# EAGLE board csa_blitter-v2.1b (EAGLE 5.11), part 1 of 2
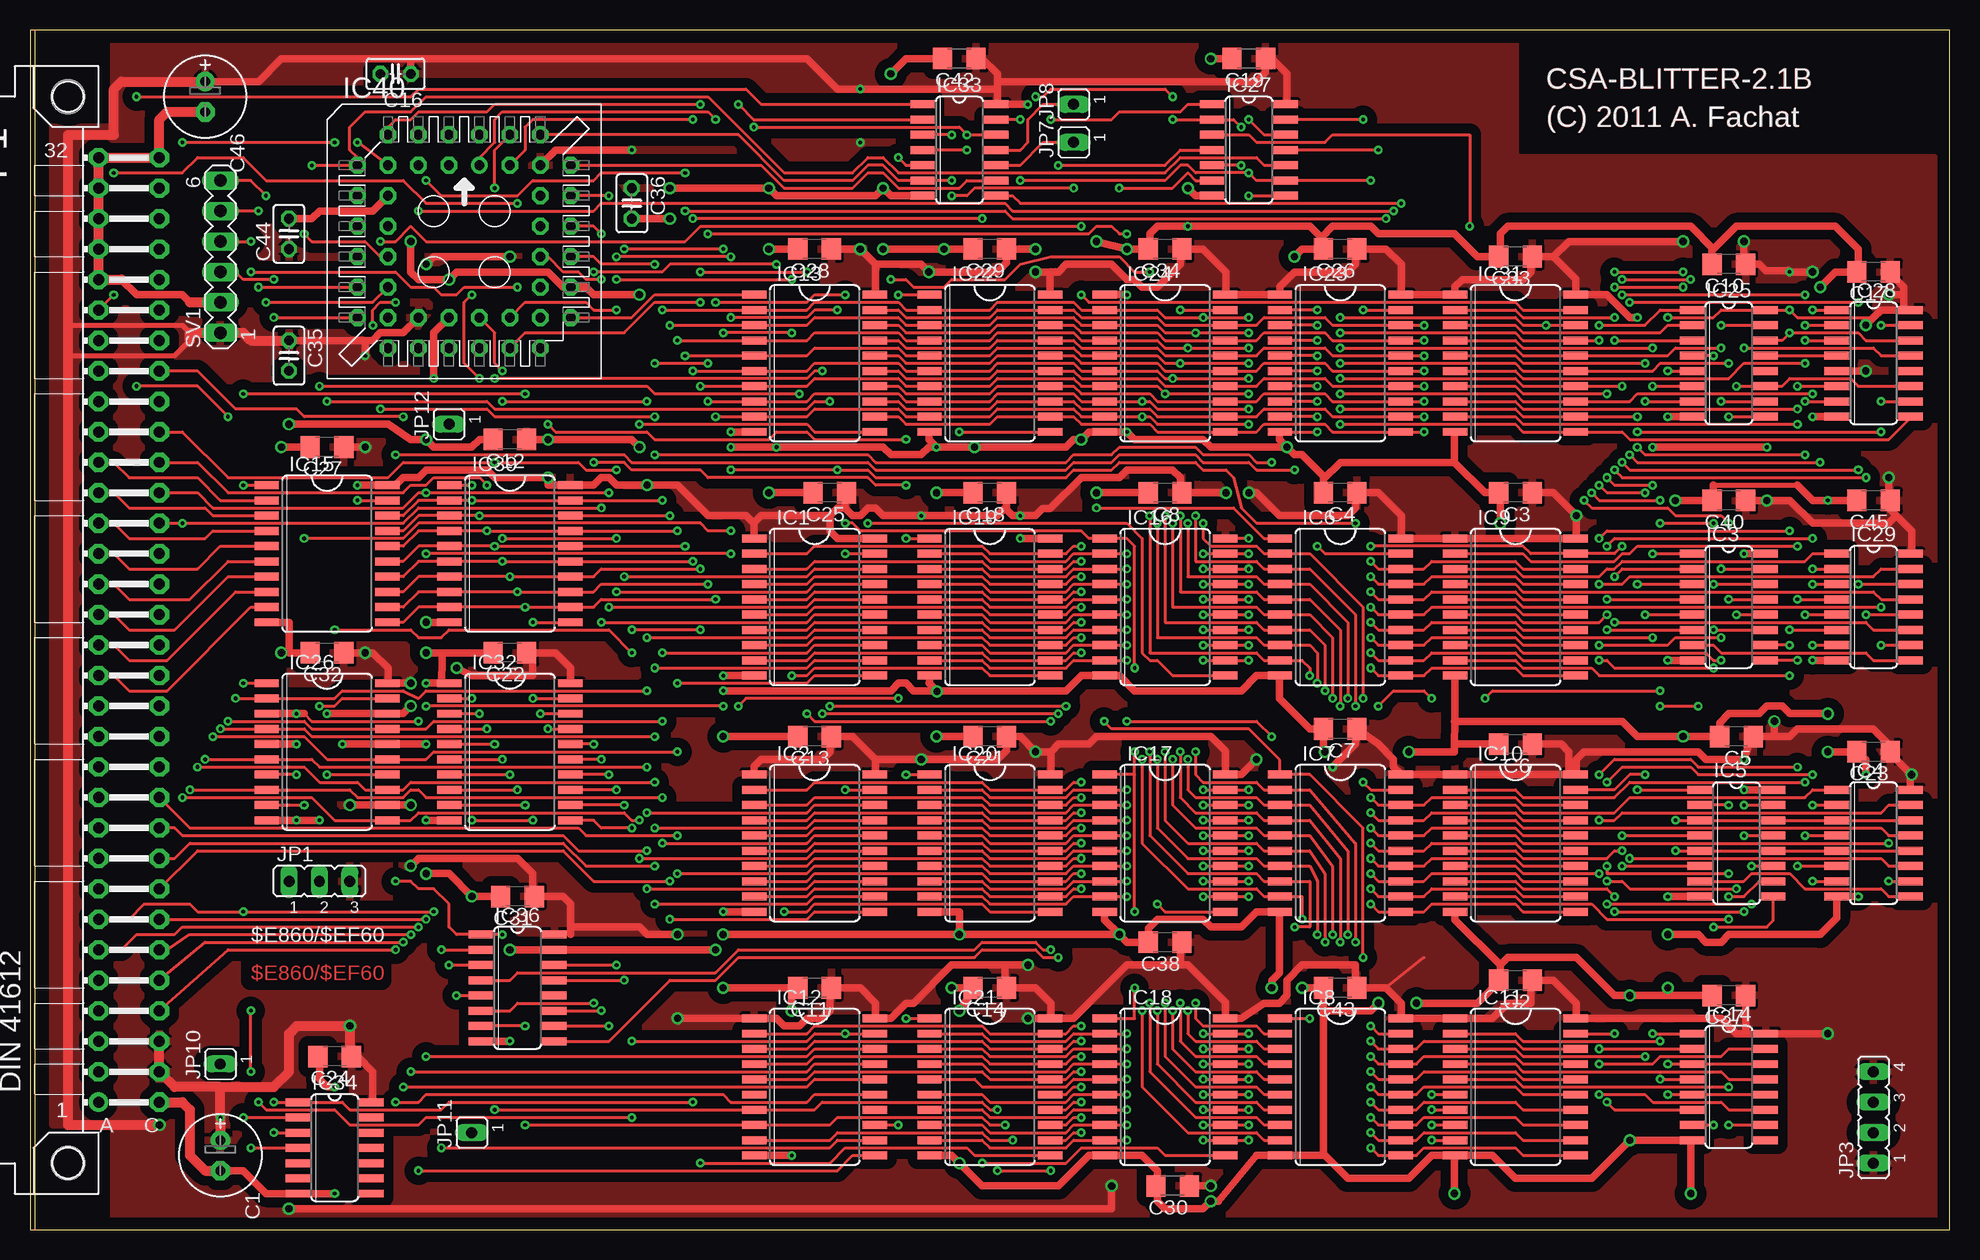
[diagram p2: board, top side]
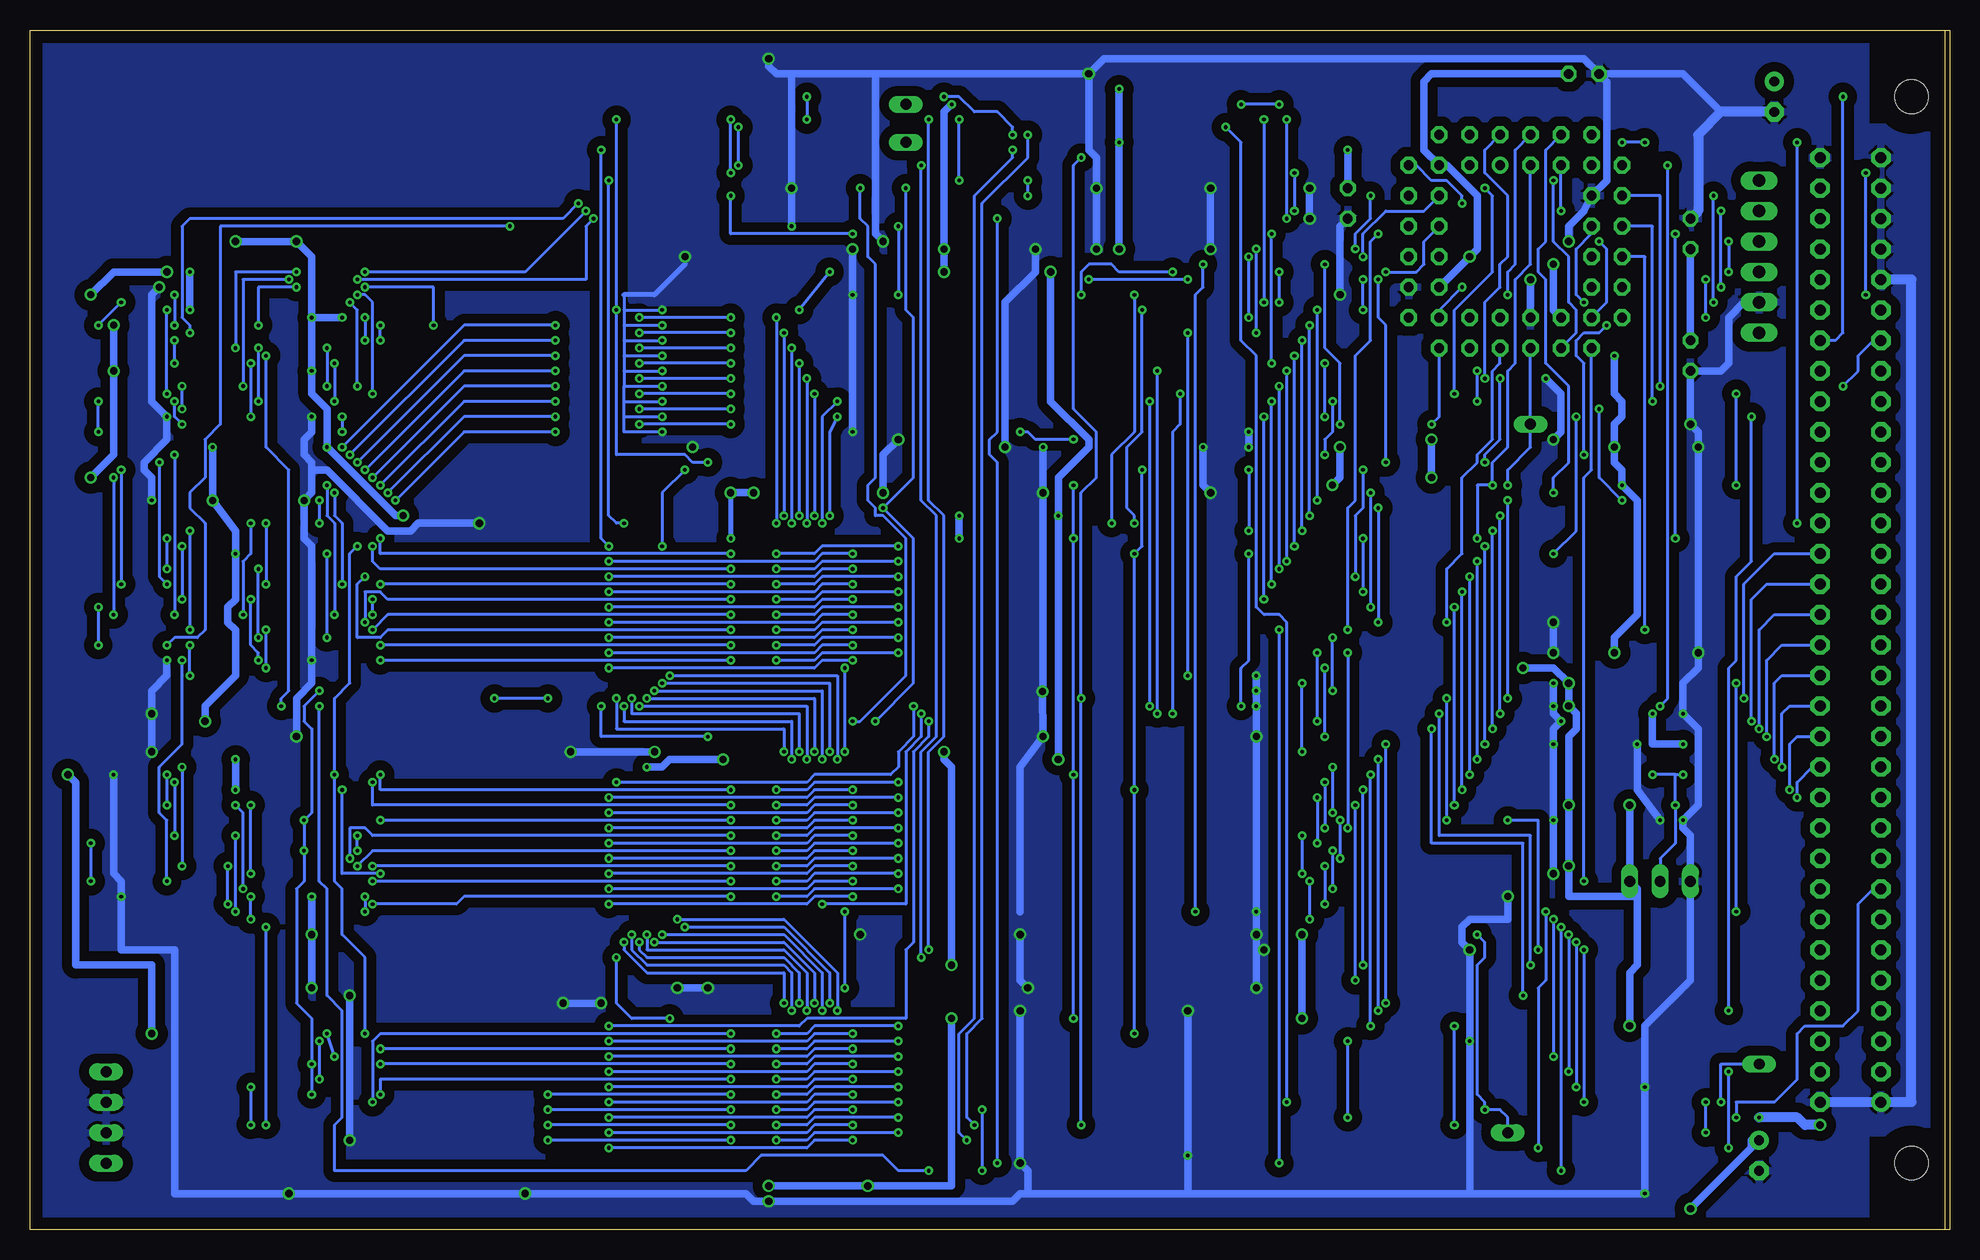
[diagram p3: board, bottom side, seen from below]

Size 160 x 100.03 mm. Coordinates in mm from the lower left corner, seen from the top.
Outline: 0,0.01 160,0.01 160,100.01 0,100.01 0,0.01
Copper layers (1*16): Top 0.035mm / dielectric 1.5mm / Bottom 0.035mm
Design rules "default": minimum track width 10mil, minimum drill 12mil, track to track 6mil, track to pad 6mil, pad to pad 6mil, via to via 6mil, smd to smd 6mil, copper to edge 40mil, drill to drill 8mil, minimum pad ring 10mil, minimum via ring 8mil, stop-mask expansion 4mil, vias tented up to drill 0mil, thermal gap 10mil

## Footprints (pad centres in the part's own frame; a part is rotated, then mirrored left to right if it is on the bottom)
E2,5-7 = drill 0.813 pad 1.6 round: + -1.27,0 | drill 0.813 pad 1.6 octagon: - 1.27,0
C1206 = smd 1.6 x 1.8: 1 -1.4,0; 2 1.4,0
C025-025X050 = drill 0.813 octagon: 1 -1.27,0; 2 1.27,0
SO20W = smd 0.66 x 2.032: 1 -5.715,-5.029; 2 -4.445,-5.029; 3 -3.175,-5.029; 4 -1.905,-5.029; 5 -0.635,-5.029; 6 0.635,-5.029; 7 1.905,-5.029; 8 3.175,-5.029; 9 4.445,-5.029; 10 5.715,-5.029; 11 5.715,5.029; 12 4.445,5.029; 13 3.175,5.029; 14 1.905,5.029; 15 0.635,5.029; 16 -0.635,5.029; 17 -1.905,5.029; 18 -3.175,5.029; 19 -4.445,5.029; 20 -5.715,5.029
SO16 = smd 0.66 x 2.032: 1 -4.445,-3.073; 2 -3.175,-3.073; 3 -1.905,-3.073; 4 -0.635,-3.073; 5 0.635,-3.073; 6 1.905,-3.073; 7 3.175,-3.073; 8 4.445,-3.073; 9 4.445,3.073; 10 3.175,3.073; 11 1.905,3.073; 12 0.635,3.073; 13 -0.635,3.073; 14 -1.905,3.073; 15 -3.175,3.073; 16 -4.445,3.073
SO14 = smd 0.66 x 2.032: 1 -3.81,-3.073; 2 -2.54,-3.073; 3 -1.27,-3.073; 4 0,-3.073; 5 1.27,-3.073; 6 2.54,-3.073; 7 3.81,-3.073; 8 3.81,3.073; 9 2.54,3.073; 10 1.27,3.073; 11 0,3.073; 12 -1.27,3.073; 13 -2.54,3.073; 14 -3.81,3.073
PLCC-S44 = drill 0.813 pad 1.397 round: 1 1.27,6.35 | drill 0.813 pad 1.397 octagon: 2 -1.27,8.89; 3 -1.27,6.35; 4 -3.81,8.89; 5 -3.81,6.35; 6 -6.35,8.89; 7 -8.89,6.35; 8 -6.35,6.35; 9 -8.89,3.81; 10 -6.35,3.81; 11 -8.89,1.27; 12 -6.35,1.27; 13 -8.89,-1.27; 14 -6.35,-1.27; 15 -8.89,-3.81; 16 -6.35,-3.81; 17 -8.89,-6.35; 18 -6.35,-8.89; 19 -6.35,-6.35; 20 -3.81,-8.89; 21 -3.81,-6.35; 22 -1.27,-8.89; 23 -1.27,-6.35; 24 1.27,-8.89; 25 1.27,-6.35; 26 3.81,-8.89; 27 3.81,-6.35; 28 6.35,-8.89; 29 8.89,-6.35; 30 6.35,-6.35; 31 8.89,-3.81; 32 6.35,-3.81; 33 8.89,-1.27; 34 6.35,-1.27; 35 8.89,1.27; 36 6.35,1.27; 37 8.89,3.81; 38 6.35,3.81; 39 8.89,6.35; 40 6.35,8.89; 41 6.35,6.35; 42 3.81,8.89; 43 3.81,6.35; 44 1.27,8.89
JP2 = drill 0.914 long: 1 -2.54,0; 2 0,0; 3 2.54,0
JP4 = drill 0.914 long: 1 -3.81,0; 2 -1.27,0; 3 1.27,0; 4 3.81,0
PIN = drill 0.914 long: 1 0,0
CSABUS = drill 0.914 pad 1.6 round: A1 7.62,36.83 | drill 0.914 pad 1.6 octagon: A2 7.62,34.29; A3 7.62,31.75; A4 7.62,29.21; A5 7.62,26.67; A6 7.62,24.13; A7 7.62,21.59; A8 7.62,19.05; A9 7.62,16.51; A10 7.62,13.97; A11 7.62,11.43; A12 7.62,8.89; A13 7.62,6.35; A14 7.62,3.81; A15 7.62,1.27; A16 7.62,-1.27; A17 7.62,-3.81; A18 7.62,-6.35; A19 7.62,-8.89; A20 7.62,-11.43; A21 7.62,-13.97; A22 7.62,-16.51; A23 7.62,-19.05; A24 7.62,-21.59; A25 7.62,-24.13; A26 7.62,-26.67; A27 7.62,-29.21; A28 7.62,-31.75; A29 7.62,-34.29; A30 7.62,-36.83; A31 7.62,-39.37; A32 7.62,-41.91; C1 2.54,36.83; C2 2.54,34.29; C3 2.54,31.75; C4 2.54,29.21; C5 2.54,26.67; C6 2.54,24.13; C7 2.54,21.59; C8 2.54,19.05; C9 2.54,16.51; C10 2.54,13.97; C11 2.54,11.43; C12 2.54,8.89; C13 2.54,6.35; C14 2.54,3.81; C15 2.54,1.27; C16 2.54,-1.27; C17 2.54,-3.81; C18 2.54,-6.35; C19 2.54,-8.89; C20 2.54,-11.43; C21 2.54,-13.97; C22 2.54,-16.51; C23 2.54,-19.05; C24 2.54,-21.59; C25 2.54,-24.13; C26 2.54,-26.67; C27 2.54,-29.21; C28 2.54,-31.75; C29 2.54,-34.29; C30 2.54,-36.83; C31 2.54,-39.37; C32 2.54,-41.91 | hole 2.794: 10.16,41.91; 10.16,-46.99
MA06-1 = drill 1.016 long: 1 -6.35,0; 2 -3.81,0; 3 -1.27,0; 4 1.27,0; 5 3.81,0; 6 6.35,0

## Placement (x,y rotation side)
C1  47u  [E2,5-7]  15.87,6.2 270 top
C2  100n  [C1206]  123.82,20.8 180 top
C3  100n  [C1206]  123.82,61.44 180 top
C4  100n  [C1206]  109.21,61.44 180 top
C5  100n  [C1206]  142.23,41.12 180 top
C6  100n  [C1206]  123.82,40.49 180 top
C7  100n  [C1206]  109.21,41.76 180 top
C8  100n  [C1206]  94.61,61.44 180 top
C10  100n  [C1206]  141.6,80.49 180 top
C11  100n  [C1206]  65.4,20.17 180 top
C12  100n  [C1206]  40,65.89 180 top
C13  100n  [C1206]  65.4,41.12 180 top
C14  100n  [C1206]  80,20.17 180 top
C16  100n  [C025-025X050]  30.47,96.37 180 top
C17  100n  [C1206]  153.66,79.86 180 top
C18  100n  [C1206]  80,61.44 180 top
C19  100n  [C1206]  101.59,97.64 180 top
C21  100n  [C1206]  80,41.12 180 top
C22  100n  [C1206]  40,48.11 180 top
C23  100n  [C1206]  153.66,39.85 180 top
C24  100n  [C1206]  25.39,14.45 180 top
C25  100n  [C1206]  66.67,61.44 180 top
C26  100n  [C1206]  109.21,81.76 180 top
C27  100n  [C1206]  24.76,65.25 180 top
C28  100n  [C1206]  65.4,81.76 180 top
C29  100n  [C1206]  80,81.76 180 top
C30  100n  [C1206]  95.24,3.66 180 top
C31  100n  [C1206]  40.64,27.79 180 top
C32  100n  [C1206]  24.76,48.11 180 top
C33  100n  [C1206]  123.82,81.13 180 top
C34  100n  [C1206]  94.61,81.76 180 top
C35  100n  [C025-025X050]  21.58,72.87 270 top
C36  100n  [C025-025X050]  50.16,85.57 270 top
C37  100n  [C1206]  141.6,19.53 180 top
C38  100n  [C1206]  94.61,23.98 180 top
C40  100n  [C1206]  141.6,60.81 180 top
C42  100n  [C1206]  77.46,97.64 180 top
C43  100n  [C1206]  109.21,20.17 180 top
C44  100n  [C025-025X050]  21.58,83.03 90 top
C45  100n  [C1206]  153.66,60.81 180 top
C46  47u  [E2,5-7]  14.6,94.46 270 top
IC1  74LS245DW  [SO20W]  65.4,51.92 270 top
IC2  74LS245DW  [SO20W]  65.4,32.23 270 top
IC3  74HCT283D  [SO16]  141.6,51.92 270 top
IC4  74HCT283D  [SO16]  153.66,32.23 270 top
IC5  74HCT283D  [SO16]  142.23,32.23 270 top
IC6  74LS245DW  [SO20W]  109.21,51.92 270 top
IC7  74LS245DW  [SO20W]  109.21,32.23 270 top
IC8  74LS245DW  [SO20W]  109.21,11.91 270 top
IC9  74LS245DW  [SO20W]  123.82,51.92 270 top
IC10  74LS245DW  [SO20W]  123.82,32.23 270 top
IC11  74LS245DW  [SO20W]  123.82,11.91 270 top
IC12  74LS245DW  [SO20W]  65.4,11.91 270 top
IC13  74HCT574D  [SO20W]  65.4,72.24 270 top
IC14  74HCT283D  [SO16]  141.6,11.91 270 top
IC15  74LS245DW  [SO20W]  24.76,56.36 270 top
IC16  74HCT574D  [SO20W]  94.61,51.92 270 top
IC17  74HCT574D  [SO20W]  94.61,32.23 270 top
IC18  74HCT574D  [SO20W]  94.61,11.91 270 top
IC19  74HCT574D  [SO20W]  80,51.92 270 top
IC20  74HCT574D  [SO20W]  80,32.23 270 top
IC21  74HCT574D  [SO20W]  80,11.91 270 top
IC22  74HCT574D  [SO20W]  80,72.24 270 top
IC23  74LS245DW  [SO20W]  109.21,72.24 270 top
IC24  74LS245DW  [SO20W]  94.61,72.24 270 top
IC25  74HCT193D  [SO16]  141.6,72.24 270 top
IC26  74LS688DW  [SO20W]  24.76,39.85 270 top
IC27  74ALS08D  [SO14]  101.59,90.02 270 top
IC28  74HCT193D  [SO16]  153.66,72.24 270 top
IC29  74HCT283D  [SO16]  153.66,51.92 270 top
IC31  74LS245DW  [SO20W]  123.82,72.24 270 top
IC32  74HCT574D  [SO20W]  40,39.85 270 top
IC33  74ALS04D  [SO14]  77.46,90.02 270 top
IC34  74AC06D  [SO14]  25.39,6.83 270 top
IC36  74LS257D  [SO16]  40.64,20.17 270 top
IC39  74HCT574D  [SO20W]  40,56.36 270 top
IC40  [PLCC-S44]  36.19,82.4 0 top
JP1  [JP2]  24.12,29.06 0 top
JP3  [JP4]  153.66,9.37 90 top
JP7  PIN  [PIN]  86.99,90.65 90 top
JP8  PIN  [PIN]  86.99,93.83 90 top
JP10  PIN  [PIN]  15.87,13.82 90 top
JP11  PIN  [PIN]  36.83,8.1 90 top
JP12  PIN  [PIN]  34.92,67.16 90 top
P1  CSABUS  [CSABUS]  13.33,47.47 180 top
SV1  [MA06-1]  15.87,81.13 90 top

## Tracks (layer width: path | path; a pad name or v marks a point on that pad's centre or on a via)
/ACTIVE  (via drill 0.3)
  Top 0.254: IC12.19 v67.94,16.36 65.4,16.36 64.77,15.72 v50.16,15.72 | v50.16,9.37 33.02,9.37 32.38,8.74 26.66,8.74 25.39,10.01 19.68,10.01 v19.04,10.64 | v111.75,87.48 IC27.9 102.23,87.48 v101.59,88.11 97.15,88.11 96.52,88.75 95.88,88.75 94.61,87.48 v82.55,87.48 | 70.48,56.36 IC1.19 v67.94,56.36 | v67.94,36.68 IC2.19 | IC40.14 29.2,81.13 27.93,82.4 23.49,82.4 v22.86,83.03 | v22.86,57.63 31.11,57.63 32.38,58.9 55.88,58.9 56.51,58.27 v58.41,58.27 | v58.41,63.35 v67.3,63.35 69.84,63.35 70.48,62.71 86.35,62.71 86.99,63.35 90.16,63.35 90.8,63.98 97.15,63.98 97.78,63.35 99.69,63.35 100.32,62.71 100.96,60.17 102.23,58.9 v110.48,58.9 | v82.55,92.56 IC33.13 | IC27.12 102.86,91.29 v101.59,92.56
  Bottom 0.254: v50.16,9.37 v50.16,15.72 | v111.75,87.48 111.75,59.54 111.12,58.9 v110.48,58.9 | v67.94,16.36 v67.94,36.68 v67.94,56.36 67.3,57 v67.3,63.35 | v101.59,88.11 v101.59,92.56 | v22.86,57.63 v22.86,83.03 | v58.41,63.35 v58.41,58.27 | v19.04,10.64 19.04,13.82 JP10.1 | v82.55,87.48 v82.55,92.56
/ADDROUT  (via drill 0.3)
  Top 0.254: IC11.19 v132.07,16.36 | v134.62,37.95 133.34,37.95 132.07,36.68 IC10.19 | v132.71,57 132.07,56.36 IC9.19 125.09,56.36 124.45,57 v111.75,57 | v112.39,90.02 IC27.11
  Bottom 0.254: v132.07,16.36 132.07,22.71 133.98,24.61 133.98,28.42 134.62,29.06 v134.62,37.95 134.62,44.3 133.34,45.57 133.34,56.36 v132.71,57 | v111.75,57 112.39,57.63 v112.39,90.02
/BE  (via drill 0.3)
  Top 0.254: v17.77,9.37 IC34.2
  Bottom 0.254: P1.A8 6.34,28.42 7.62,27.15 7.62,18.26 8.89,16.99 12.06,16.99 12.7,16.36 12.7,12.55 14.6,10.64 17.77,10.64 v17.77,9.37
/BOARD  (via drill 0.3)
  Top 0.254: IC27.10 102.86,88.75 102.23,89.38 95.88,89.38 94.61,88.11 72.38,88.11 71.11,89.38 69.84,89.38 68.57,88.11 62.86,88.11 56.51,94.46 33.02,94.46 31.74,93.19 27.93,93.19 26.66,91.92 26.66,90.02 27.3,89.38 IC40.7 v23.49,88.75 | v24.12,43.66 25.39,43.66 26.03,44.3 IC26.19 29.84,44.3
  Bottom 0.254: v23.49,88.75 23.49,44.3 v24.12,43.66
/DATA  (via drill 0.3)
  Top 0.254: v101.59,86.21 IC27.8 | v56.51,83.03 88.26,83.03 88.89,83.67 90.16,83.67 90.8,83.03 v91.44,83.03 | v52.07,72.24 v56.51,72.24 | v52.07,67.79 38.73,67.79 38.1,68.43 v29.2,68.43 | 29.84,60.81 IC15.19 v27.3,60.81
  Bottom 0.254: v101.59,86.21 101.59,83.03 v91.44,83.03 | v56.51,72.24 v56.51,83.03 | v52.07,67.79 v52.07,72.24 | v29.2,68.43 29.2,62.71 v27.3,60.81
/DBUS0  (via drill 0.3)
  Top 0.254: IC6.19 107.94,56.36 v107.31,57 | v105.41,63.35 102.23,63.35 101.59,63.98 97.78,63.98 97.15,64.62 90.8,64.62 90.16,63.98 86.99,63.98 86.35,63.35 70.48,63.35 69.84,63.98 50.16,63.98 49.53,64.62 v30.47,64.62 | v28.57,75.41 28.57,76.68 29.2,77.32 v30.47,77.32
  Bottom 0.254: v107.31,57 107.31,61.44 v105.41,63.35 | v30.47,64.62 30.47,72.24 31.11,72.87 31.11,74.14 30.47,74.78 29.2,74.78 v28.57,75.41 | v30.47,77.32 31.11,77.95 31.11,81.76 29.84,83.03 IC40.12
/DBUS1  (via drill 0.3)
  Top 0.254: IC7.19 111.75,36.68 v111.12,37.31 | v66.67,43.66 v86.35,43.66 | v66.67,69.06 65.4,69.06 64.77,68.43 38.73,68.43 38.1,69.06 v24.76,69.06
  Bottom 0.254: v111.12,37.31 95.24,37.31 94.61,37.95 88.26,37.95 87.62,38.58 87.62,39.85 86.35,41.12 v86.35,43.66 | v66.67,69.06 v66.67,43.66 | IC40.11 24.76,83.67 v24.76,69.06
/DBUS2  (via drill 0.3)
  Top 0.254: IC8.19 112.39,16.36 v111.75,16.99 | v85.08,42.39 65.4,42.39 v64.77,43.03 | v24.12,70.33 51.43,70.33 52.07,69.7 v64.13,69.7
  Bottom 0.254: v111.75,16.99 95.88,16.99 95.24,17.63 86.99,17.63 86.99,23.34 86.35,23.98 86.35,39.85 85.08,41.12 v85.08,42.39 | v64.13,69.7 64.13,67.16 64.77,66.52 v64.77,43.03 | IC40.9 24.12,86.21 v24.12,70.33
/DECCNT
  Top 0.254: IC25.13 IC28.4
/DTR  (via drill 0.3)
  Top 0.254: 34.92,62.08 IC39.1 v36.83,62.08
  Bottom 0.254: v36.83,62.08 36.83,63.35 34.92,65.25 JP12.1 IC40.22
/DTW  (via drill 0.3)
  Top 0.254: 45.08,50.65 IC39.11 v41.91,50.65
  Bottom 0.254: IC40.24 37.46,72.24 38.1,71.6 38.1,65.89 39.37,64.62 39.37,63.98 40.64,62.71 40.64,56.36 41.91,55.09 v41.91,50.65
/IOSEL  (via drill 0.3)
  Top 0.254: IC12.12 67.3,7.47 66.67,6.83 v34.29,6.83 | v33.65,26.52 v17.77,26.52 13.97,26.52 13.33,27.15 9.52,27.15 8.25,25.88 P1.A7 | v17.77,45.57 IC26.1
  Bottom 0.254: v34.29,6.83 34.29,20.17 33.65,20.8 v33.65,26.52 | v17.77,26.52 v17.77,45.57
/IOSELOUT  (via drill 0.3)
  Top 0.254: v41.27,16.99 IC36.7 | v41.27,8.74 IC12.8 66.67,8.74 67.3,9.37 79.37,9.37 80,8.74 v81.27,8.74 | 74.29,91.29 IC33.3 v76.83,91.29
  Bottom 0.254: v41.27,8.74 v41.27,16.99 | v81.27,8.74 81.91,9.37 81.91,16.36 80.64,17.63 80.64,85.57 76.83,89.38 v76.83,91.29
/MEMSEL  (via drill 0.3)
  Top 0.254: IC12.11 68.57,6.2 67.3,4.93 v32.38,4.93 | v32.38,25.25 12.7,25.25 12.06,24.61 8.89,24.61 7.62,23.34 P1.A6
  Bottom 0.254: v32.38,25.25 v32.38,4.93
/MEMSELOUT  (via drill 0.3)
  Top 0.254: IC12.9 66.67,7.47 67.3,8.1 79.37,8.1 80,7.47 v81.91,7.47 | 74.29,90.02 IC33.4 v78.1,90.02
  Bottom 0.254: v81.91,7.47 82.55,8.1 82.55,16.36 81.27,17.63 81.27,86.21 78.1,89.38 v78.1,90.02
/NULLINC  (via drill 0.3)
  Top 0.254: v111.12,76.68 IC23.19 | IC40.25 38.73,74.78 38.73,72.24 v39.37,71.6 | v39.37,69.06 v51.43,69.06 | v52.07,64.62 69.84,64.62 70.48,63.98 86.35,63.98 86.99,64.62 90.16,64.62 90.8,65.25 97.15,65.25 97.78,64.62 101.59,64.62 102.23,63.98 v103.5,63.98 | v111.12,92.56 IC27.13
  Bottom 0.254: v103.5,63.98 104.77,63.98 105.41,64.62 111.12,64.62 v111.12,76.68 v111.12,92.56 | v39.37,69.06 v39.37,71.6 | v51.43,69.06 51.43,66.52 52.07,65.89 v52.07,64.62
/PHI2  (via drill 0.3)
  Top 0.254: IC40.6 29.84,91.92 30.47,92.56 31.74,92.56 32.38,93.19 38.1,93.19 38.73,93.83 v55.88,93.83 | v59.05,93.83 60.32,92.56 IC33.2
  Bottom 0.254: v55.88,93.83 v59.05,93.83
/RCNT  (via drill 0.3)
  Top 0.254: IC31.19 124.45,76.68 123.82,77.32 88.26,77.32 v87.62,77.95 | v87.62,83.67 55.88,83.67 54.61,82.4 33.02,82.4 31.74,83.67 30.47,82.4 v29.2,82.4
  Bottom 0.254: v87.62,83.67 v87.62,77.95 | v29.2,82.4 28.57,81.76 28.57,77.32 IC40.19
/RDINC  (via drill 0.3)
  Top 0.254: v95.88,76.68 IC24.19 | v93.34,79.86 92.07,79.86 90.8,81.13 85.08,81.13 82.55,80.49 81.27,79.22 76.83,79.22 76.19,78.59 73.66,78.59 73.02,79.22 v71.75,79.22 | v48.89,79.22 v63.5,79.22 | v48.89,76.68 46.98,76.68 46.35,77.32 41.27,77.32 IC40.27
  Bottom 0.254: v93.34,79.86 v95.88,76.68 | v63.5,79.22 v71.75,79.22 | v48.89,76.68 v48.89,79.22
/RES  (via drill 0.3)
  Top 0.254: IC33.9 78.1,87.48 77.46,86.84 72.38,86.84 71.11,88.11 69.84,88.11 68.57,86.84 62.86,86.84 60.96,88.75 IC40.39 | v40.64,85.57 33.02,85.57 31.11,87.48 19.68,87.48 17.77,89.38 13.97,89.38 12.7,88.11 v6.98,88.11 | P1.A27 v6.98,77.95
  Bottom 0.254: IC40.39 44.45,88.75 43.18,87.48 41.91,87.48 40.64,86.21 v40.64,85.57 | v6.98,77.95 v6.98,88.11
/RLDA  (via drill 0.3)
  Top 0.254: IC18.1 92.07,17.63 v92.07,20.17 | v92.07,26.52 92.07,37.95 | 89.53,37.95 IC17.1 92.07,37.95 | v92.07,46.84 92.07,57 91.44,57.63 IC16.1 88.26,57.63 87.62,58.27 69.21,58.27 68.57,58.9 v67.94,58.9 | 92.07,37.95 v92.07,39.85 | v67.3,76.68 65.4,76.68 64.77,76.05 v58.41,76.05 | v58.41,81.13 v48.89,81.13
  Bottom 0.254: v92.07,20.17 v92.07,26.52 | v92.07,39.85 v92.07,46.84 | v67.94,58.9 67.94,59.54 68.57,60.17 68.57,65.25 67.3,66.52 v67.3,76.68 | IC40.38 43.81,84.94 46.98,84.94 48.89,83.03 v48.89,81.13 | v58.41,76.05 v58.41,81.13
/RLDI
  Top 0.254: IC13.1 52.07,77.95 50.16,76.05 IC40.29
/RSTA  (via drill 0.3)
  Top 0.254: v73.02,17.63 IC21.1 | v73.02,37.95 IC20.1 | v73.02,57.63 IC19.1 | IC40.34 43.18,81.13 44.45,79.86 45.72,79.86 46.35,79.22 v47.62,79.22 | v46.98,63.98 49.53,63.98 50.16,63.35 55.88,63.35 56.51,62.71 69.84,62.71 70.48,62.08 v73.02,62.08
  Bottom 0.254: v73.02,17.63 v73.02,37.95 v73.02,57.63 v73.02,62.08 | v47.62,79.22 47.62,76.05 46.98,75.41 v46.98,63.98
/RSTI  (via drill 0.3)
  Top 0.254: v72.38,77.95 IC22.1 | v55.88,79.86 v64.77,79.86 | v55.88,77.32 52.07,77.32 49.53,74.78 41.27,74.78 IC40.26
  Bottom 0.254: v72.38,77.95 72.38,79.86 71.75,80.49 69.84,80.49 69.21,79.86 v64.77,79.86 | v55.88,77.32 v55.88,79.86
/WCNT  (via drill 0.3)
  Top 0.254: 156.84,70.33 IC28.11 152.39,70.33 151.76,70.97 146.68,70.97 146.04,70.33 IC25.11 v142.23,70.33 | v132.71,79.22 v138.42,79.22 | v113.02,84.3 81.91,84.3 81.27,84.94 v54.61,84.94 | v54.61,88.11 47.62,88.11 46.98,87.48 41.91,87.48 40.64,86.21 34.29,86.21 v33.02,87.48
  Bottom 0.254: v142.23,70.33 142.23,79.22 v138.42,79.22 | v132.71,79.22 113.66,79.22 113.66,83.67 v113.02,84.3 | v54.61,88.11 v54.61,84.94 | v33.02,87.48 33.02,82.4 31.74,81.13 31.74,77.32 31.11,76.68 31.11,74.78 IC40.20
/WCTRL  (via drill 0.3)
  Top 0.254: v25.39,50.01 31.74,50.01 32.38,49.38 34.29,49.38 34.92,50.01 48.26,50.01 v50.16,48.11 | v50.16,33.5 47.62,33.5 46.98,34.14 IC32.11
  Bottom 0.254: IC40.13 25.39,81.13 v25.39,50.01 | v50.16,48.11 v50.16,33.5
/WLDA0  (via drill 0.3)
  Top 0.254: IC16.11 95.24,46.2 93.97,47.47 93.34,47.47 92.7,48.11 92.7,57.63 91.44,58.9 v69.84,58.9 | v67.94,77.95 65.4,77.95 64.77,77.32 v57.15,77.32 | v57.15,92.56 56.51,93.19 39.37,93.19 38.73,92.56 38.73,90.65 37.46,89.38 IC40.1
  Bottom 0.254: v69.84,58.9 69.84,64.62 67.94,66.52 v67.94,77.95 | v57.15,92.56 v57.15,77.32
/WLDA1  (via drill 0.3)
  Top 0.254: IC17.11 94.61,26.52 v93.97,27.15 | v66.03,43.03 v85.72,43.03 | v66.03,71.6 65.4,71.6 64.77,70.97 v38.73,70.97
  Bottom 0.254: v93.97,27.15 86.99,27.15 86.99,39.85 85.72,41.12 v85.72,43.03 | v66.03,43.03 v66.03,71.6 | IC40.44 38.73,90.02 38.73,88.11 36.83,86.21 36.83,81.13 37.46,80.49 37.46,78.59 38.73,77.32 v38.73,70.97
/WLDA2  (via drill 0.3)
  Top 0.254: IC18.11 94.61,6.2 93.97,6.83 87.62,6.83 86.35,5.56 v79.37,5.56 | v79.37,84.3 v55.24,84.3 | v55.24,92.56 41.91,92.56 41.27,91.92 41.27,90.02 IC40.43
  Bottom 0.254: v79.37,5.56 79.37,63.98 80,64.62 80,65.89 79.37,66.52 v79.37,84.3 | v55.24,84.3 v55.24,92.56
/WLDI  (via drill 0.3)
  Top 0.254: IC13.11 65.4,66.52 64.77,67.16 v50.8,67.16 | IC40.33 46.98,81.13 47.62,80.49 v52.07,80.49
  Bottom 0.254: v50.8,67.16 50.8,72.24 52.07,73.51 v52.07,80.49
/WSTA0  (via drill 0.3)
  Top 0.254: IC19.11 80,46.2 79.37,46.84 65.4,46.84 64.77,46.2 v63.5,46.2 | v48.26,86.21 IC40.37 | v57.78,81.76 v49.53,81.76 | v63.5,74.78 v57.78,74.78
  Bottom 0.254: v63.5,46.2 v63.5,74.78 | v48.26,86.21 48.26,84.3 49.53,83.03 v49.53,81.76 | v57.78,74.78 v57.78,81.76
/WSTA1  (via drill 0.3)
  Top 0.254: IC20.11 80,26.52 79.37,27.15 65.4,27.15 64.77,26.52 v62.86,26.52 | v62.23,80.49 53.34,80.49 52.7,79.86 v46.98,79.86
  Bottom 0.254: v62.86,26.52 62.86,77.95 62.23,78.59 v62.23,80.49 | v46.98,79.86 44.45,79.86 43.81,80.49 43.81,82.4 IC40.36
/WSTA2  (via drill 0.3)
  Top 0.254: IC21.11 78.73,6.2 78.1,6.83 67.94,6.83 66.67,5.56 v55.88,5.56 | v55.88,50.01 v50.16,50.01 | IC40.35 46.98,83.67 v47.62,83.03
  Bottom 0.254: v55.88,5.56 v55.88,50.01 | v47.62,83.03 48.26,82.4 48.26,74.14 49.53,72.87 49.53,60.81 50.16,60.17 v50.16,50.01
/WSTI  (via drill 0.3)
  Top 0.254: v77.46,66.52 IC22.11 | v73.02,65.89 65.4,65.89 64.77,66.52 62.23,66.52 61.59,65.89 52.07,65.89 51.43,66.52 43.81,66.52 v43.18,67.16
  Bottom 0.254: v73.02,65.89 76.19,65.89 76.83,66.52 v77.46,66.52 | v43.18,67.16 42.54,67.79 IC40.28
A0  (via drill 0.3)
  Top 0.254: IC1.18 65.4,55.09 64.77,54.46 v49.53,54.46 | P1.C23 12.7,66.52 16.5,62.71 29.84,62.71 31.11,63.98 v38.73,63.98 45.72,63.98 46.35,63.35 v48.89,63.35 | v36.83,77.95 36.19,77.32 36.19,72.24 v37.46,70.97
  Bottom 0.254: v48.89,63.35 48.89,60.17 49.53,59.54 v49.53,54.46 | IC40.2 36.19,90.02 36.19,80.49 36.83,79.86 v36.83,77.95 | v37.46,70.97 37.46,65.89 38.73,64.62 v38.73,63.98
A1  (via drill 0.3)
  Top 0.254: IC1.17 65.4,53.82 64.77,53.19 v48.89,53.19 | P1.C22 13.97,63.98 16.5,61.44 31.11,61.44 31.74,62.08 33.02,62.08 33.65,62.71 37.46,62.71 v38.1,62.08 | v39.37,57.63 v48.89,57.63
  Bottom 0.254: v39.37,57.63 39.37,62.08 v38.1,62.08 38.1,63.98 36.83,65.25 36.83,71.6 36.19,72.24 36.19,79.22 34.92,80.49 IC40.3 | v48.89,57.63 v48.89,53.19
A2  (via drill 0.3)
  Top 0.254: IC1.16 65.4,52.55 64.77,51.92 v48.26,51.92 | P1.C21 13.97,61.44 15.24,60.17 31.11,60.17 32.38,61.44 v33.02,61.44 v48.26,61.44
  Bottom 0.254: v48.26,61.44 v48.26,51.92 | IC40.4 33.65,90.02 33.65,82.4 34.29,81.76 34.29,79.86 33.65,79.22 33.65,72.24 31.74,70.33 31.74,63.98 33.02,62.71 v33.02,61.44
A3  (via drill 0.3)
  Top 0.254: IC1.15 65.4,51.28 64.77,50.65 v47.62,50.65 | P1.C20 v12.7,58.9 31.11,58.9 32.38,60.17 v47.62,60.17 | v27.3,90.65 IC40.8 | v12.7,90.65 v25.39,90.65
  Bottom 0.254: v47.62,60.17 v47.62,50.65 | v25.39,90.65 v27.3,90.65 | v12.7,58.9 v12.7,90.65
A4  (via drill 0.3)
  Top 0.254: IC1.14 65.4,50.01 64.77,49.38 v51.43,49.38 | v17.14,44.3 IC26.2 25.39,44.3 26.03,44.93 31.11,44.93 32.38,44.3 33.02,44.93 v51.43,44.93
  Bottom 0.254: P1.C19 14.6,56.36 17.14,53.82 v17.14,44.3 | v51.43,44.93 v51.43,49.38
A5  (via drill 0.3)
  Top 0.254: IC1.13 65.4,48.74 64.77,48.11 v52.7,48.11 | v16.5,42.39 22.86,42.39 23.49,41.76 IC26.17 | IC26.17 29.84,41.76 | IC26.17 33.02,41.76 33.65,42.39 v52.7,42.39
  Bottom 0.254: P1.C18 15.24,53.82 16.5,52.55 v16.5,42.39 | v52.7,42.39 v52.7,48.11
A6  (via drill 0.3)
  Top 0.254: IC1.12 65.4,47.47 64.77,46.84 v52.07,46.84 | v15.87,41.76 IC26.4 22.86,41.76 23.49,41.12 v52.07,41.12
  Bottom 0.254: P1.C17 14.6,51.28 15.87,50.01 v15.87,41.76 | v52.07,41.12 v52.07,46.84
A7  (via drill 0.3)
  Top 0.254: IC1.11 65.4,46.2 64.77,45.57 v53.97,45.57 | v15.24,41.12 22.86,41.12 24.76,39.22 IC26.15 | IC26.15 29.84,39.22 | IC26.15 33.02,39.22 33.65,39.85 v53.97,39.85
  Bottom 0.254: P1.C16 13.97,48.74 15.24,47.47 v15.24,41.12 | v53.97,39.85 v53.97,45.57
A8  (via drill 0.3)
  Top 0.254: IC2.18 65.4,35.41 64.77,34.77 v51.43,34.77 | v14.6,39.22 IC26.6 23.49,39.22 24.12,38.58 v51.43,38.58
  Bottom 0.254: P1.C15 13.97,46.2 14.6,45.57 v14.6,39.22 | v51.43,38.58 v51.43,34.77
A9  (via drill 0.3)
  Top 0.254: IC2.17 65.4,34.14 64.77,33.5 v52.07,33.5 | v13.97,38.58 22.86,38.58 24.12,37.31 27.3,37.31 27.93,36.68 IC26.13 | IC26.13 29.84,36.68 | IC26.13 31.11,36.68 31.74,37.31 v52.07,37.31
  Bottom 0.254: P1.C14 13.33,43.66 13.97,43.03 v13.97,38.58 | v52.07,37.31 v52.07,33.5
A10  (via drill 0.3)
  Top 0.254: IC2.16 65.4,32.87 64.77,32.23 v52.7,32.23 | v13.33,36.68 IC26.8 26.66,36.68 27.3,36.04 31.11,36.04 31.74,36.68 32.38,36.68 33.02,36.04 v52.7,36.04
  Bottom 0.254: P1.C13 12.7,41.12 13.33,40.49 v13.33,36.68 | v52.7,36.04 v52.7,32.23
A11  (via drill 0.3)
  Top 0.254: IC2.15 65.4,31.6 64.77,30.96 v50.8,30.96 | v12.7,36.04 23.49,36.04 25.39,34.14 IC26.11 | IC26.11 29.84,34.14 | IC26.11 31.74,34.14 32.38,34.77 49.53,34.77 50.16,34.14 v50.8,34.14
  Bottom 0.254: P1.C12 11.43,38.58 12.7,37.31 v12.7,36.04 | v50.8,34.14 v50.8,30.96
A12  (via drill 0.3)
  Top 0.254: IC2.14 65.4,30.33 64.77,29.69 v53.97,29.69 | P1.C11 13.33,33.5 45.72,33.5 46.35,32.87 v53.97,32.87
  Bottom 0.254: v53.97,32.87 v53.97,29.69
A13  (via drill 0.3)
  Top 0.254: IC2.13 65.4,29.06 64.77,28.42 v51.43,28.42 | P1.C10 12.06,33.5 12.7,32.87 44.45,32.87 45.72,31.6 v51.43,31.6
  Bottom 0.254: v51.43,31.6 v51.43,28.42
A14  (via drill 0.3)
  Top 0.254: IC2.12 65.4,27.79 64.77,27.15 v52.07,27.15 | P1.C9 12.06,30.96 13.33,32.23 44.45,32.23 46.35,30.33 v52.07,30.33
  Bottom 0.254: v52.07,30.33 v52.07,27.15
A15  (via drill 0.3)
  Top 0.254: IC2.11 65.4,26.52 64.77,25.88 v53.34,25.88 | P1.C8 13.97,31.6 44.45,31.6 46.98,29.06 v53.34,29.06
  Bottom 0.254: v53.34,29.06 v53.34,25.88
A16  (via drill 0.3)
  Top 0.254: IC12.18 65.4,15.09 64.77,14.45 v33.02,14.45 | P1.C7 v33.02,25.88
  Bottom 0.254: v33.02,25.88 v33.02,14.45
A17  (via drill 0.3)
  Top 0.254: IC12.17 65.4,13.82 64.77,13.18 v31.74,13.18 | P1.C6 11.43,23.34 13.33,24.61 v31.74,24.61
  Bottom 0.254: v31.74,24.61 v31.74,13.18
A18  (via drill 0.3)
  Top 0.254: IC12.16 65.4,12.55 64.77,11.91 v31.11,11.91 | P1.C5 14.6,23.98 v31.11,23.98
  Bottom 0.254: v31.11,23.98 v31.11,11.91
A19  (via drill 0.3)
  Top 0.254: IC12.15 65.4,11.28 64.77,10.64 58.41,10.64 57.78,11.28 33.02,11.28 32.38,10.64 v30.47,10.64 | P1.C4 16.5,23.34 v30.47,23.34
  Bottom 0.254: v30.47,23.34 v30.47,10.64
ACTIVE  (via drill 0.3)
  Top 0.254: 98.42,88.75 IC27.5 v100.96,88.75 | IC33.12 v78.1,91.29 77.46,91.92 v60.32,91.92 | v83.81,94.46 84.45,94.46 85.08,95.1 94.61,95.1 v95.24,94.46 | v100.96,91.92 100.32,92.56 IC27.2 v95.24,92.56 | v20.31,8.1 IC34.3 | v20.31,10.64 IC34.1 26.03,10.64 26.66,10.01 34.29,10.01 34.92,10.64 v55.24,10.64
  Bottom 0.254: v78.1,91.29 78.1,91.92 79.37,93.19 81.27,93.19 82.55,94.46 v83.81,94.46 | v95.24,94.46 v95.24,92.56 | v100.96,91.92 v100.96,88.75 | v20.31,8.1 v20.31,10.64 | v55.24,10.64 55.24,50.65 55.88,51.28 57.15,51.28 57.78,51.92 57.78,72.87 59.05,74.14 59.05,90.65 v60.32,91.92
BD0
  Top 0.254: P1.A22 6.98,63.98 8.25,62.71 13.97,62.71 15.87,60.81 IC15.2
BD1
  Top 0.254: P1.A21 6.98,61.44 8.25,60.17 14.6,60.17 15.24,59.54 IC15.3
BD2
  Top 0.254: P1.A20 6.98,58.9 8.25,57.63 14.6,57.63 15.24,58.27 IC15.4
BD3
  Top 0.254: P1.A19 6.98,56.36 8.25,55.09 13.97,55.09 15.87,57 IC15.5
BD4
  Top 0.254: P1.A18 6.98,53.82 8.25,52.55 13.33,52.55 16.5,55.73 IC15.6
BD5
  Top 0.254: P1.A17 6.98,51.28 8.25,50.01 12.06,50.01 16.5,54.46 IC15.7
BD6
  Top 0.254: P1.A16 6.98,48.74 8.25,47.47 11.43,47.47 17.14,53.19 IC15.8
BD7
  Top 0.254: P1.A15 6.98,46.2 8.25,44.93 11.43,44.93 18.41,51.92 IC15.9
C_CARRY  (via drill 0.3)
  Top 0.254: IC36.4 40,20.8 40.64,21.44 57.15,21.44 59.05,23.34 78.73,23.34 79.37,23.98 83.81,23.98 84.45,23.34 v85.08,23.34 | IC27.1 96.52,93.83 95.88,93.19 90.8,93.19 90.16,92.56 v85.08,92.56
  Bottom 0.254: v85.08,23.34 85.08,39.85 83.81,41.12 83.81,59.54 85.08,60.81 v85.08,92.56
C_COMPL  (via drill 0.3)
  Top 0.254: IC36.9 48.26,15.72 53.34,20.8 57.15,20.8 59.05,22.71 78.73,22.71 79.37,23.34 83.81,23.34 84.45,22.71 v85.72,22.71 | IC27.4 95.88,90.02 94.61,88.75 v85.72,88.75
  Bottom 0.254: v85.72,22.71 85.72,39.85 84.45,41.12 84.45,59.54 85.72,60.81 v85.72,88.75
CARRY  (via drill 0.3)
  Top 0.254: v148.59,48.74 IC29.7 | IC27.3 101.59,91.29 102.23,90.65 107.94,90.65 108.58,91.29 120.01,91.29 v120.01,83.67
  Bottom 0.254: v148.59,48.74 147.95,49.38 146.04,49.38 145.41,50.01 145.41,58.9 146.68,60.17 146.68,61.44 145.41,62.71 145.41,65.89 144.14,67.16 144.14,83.67 v120.01,83.67
CNT0  (via drill 0.3)
  Top 0.254: IC31.2 123.82,76.68 124.45,76.05 v132.07,76.05 | v132.07,74.14 IC25.3
  Bottom 0.254: v132.07,76.05 v132.07,74.14
CNT1
  Top 0.254: IC31.3 123.82,75.41 124.45,74.78 135.88,74.78 136.52,75.41 IC25.2
CNT2  (via drill 0.3)
  Top 0.254: IC31.4 123.82,74.14 124.45,73.51 v135.25,73.51 | v135.25,70.33 IC25.6
  Bottom 0.254: v135.25,73.51 v135.25,70.33
CNT3  (via drill 0.3)
  Top 0.254: IC31.5 123.82,72.87 124.45,72.24 v134.62,72.24 | v134.62,69.06 IC25.7
  Bottom 0.254: v134.62,72.24 v134.62,69.06
CNT4  (via drill 0.3)
  Top 0.254: IC31.6 123.82,71.6 124.45,70.97 141.6,70.97 142.87,72.24 v147.95,72.24 | v147.95,74.14 IC28.3
  Bottom 0.254: v147.95,72.24 v147.95,74.14
CNT5  (via drill 0.3)
  Top 0.254: IC31.7 123.82,70.33 124.45,69.7 v131.44,69.7 | v132.71,77.95 v147.95,77.95 | v147.95,75.41 IC28.2
  Bottom 0.254: v131.44,69.7 131.44,77.32 132.07,77.95 v132.71,77.95 | v147.95,77.95 v147.95,75.41
CNT6  (via drill 0.3)
  Top 0.254: IC31.8 123.82,69.06 124.45,68.43 v147.31,68.43 | v147.31,70.33 IC28.6
  Bottom 0.254: v147.31,68.43 v147.31,70.33
CNT7  (via drill 0.3)
  Top 0.254: IC31.9 123.82,67.79 124.45,67.16 v147.31,67.16 | v147.95,69.06 IC28.7
  Bottom 0.254: v147.31,67.16 147.95,67.79 v147.95,69.06
CNTEND  (via drill 0.3)
  Top 0.254: IC28.13 154.3,72.87 153.66,73.51 v142.87,73.51 | v132.07,79.86 v137.79,79.86 | v113.66,84.94 81.91,84.94 81.27,85.57 47.62,85.57 46.98,84.94 v32.38,84.94
  Bottom 0.254: v142.87,73.51 142.87,79.86 v137.79,79.86 | v132.07,79.86 118.74,79.86 v113.66,84.94 | v32.38,84.94 IC40.5
COMPLEMENT  (via drill 0.3)
  Top 0.254: v137.16,31.6 139.06,31.6 | v137.16,34.14 139.06,34.14 | 139.06,31.6 IC5.5 | 139.06,31.6 IC5.12 150.49,31.6 | 139.06,34.14 IC5.3 | 139.06,34.14 IC5.14 150.49,34.14 | 150.49,34.14 IC4.3 | 150.49,34.14 IC4.14 | 150.49,31.6 IC4.5 | 150.49,31.6 IC4.12 | IC14.14 IC14.3 v136.52,13.82 | 144.78,11.28 IC14.12 139.06,11.28 | 139.06,11.28 IC14.5 | v136.52,11.28 139.06,11.28 | v135.88,44.93 121.91,44.93 v121.28,44.3 | v116.83,44.3 116.2,44.93 113.66,44.93 v112.39,43.66 | v103.5,41.12 102.23,42.39 v91.44,42.39 | v90.8,86.84 95.24,86.84 96.52,88.11 97.15,87.48 IC27.6
  Bottom 0.254: v136.52,11.28 v136.52,13.82 136.52,17.63 137.79,18.9 137.79,28.42 137.16,29.06 v137.16,31.6 v137.16,34.14 136.52,34.77 136.52,41.76 137.16,42.39 137.16,43.66 v135.88,44.93 | v116.83,44.3 v121.28,44.3 | v112.39,43.66 112.39,41.12 v103.5,41.12 | v91.44,42.39 90.8,42.39 86.99,46.2 86.99,57.63 88.89,59.54 89.53,59.54 89.53,60.17 90.16,60.81 90.16,62.08 89.53,62.71 89.53,80.49 90.16,81.13 90.16,83.67 90.8,84.3 v90.8,86.84
D0  (via drill 0.3)
  Top 0.254: v111.12,44.3 111.12,51.92 106.67,56.36 IC6.2 102.86,56.36 102.23,57 98.42,57 97.78,57.63 v97.78,58.9 | v97.15,39.85 97.15,37.95 97.78,37.31 102.23,37.31 102.86,36.68 IC7.2 106.67,36.68 110.48,32.23 v110.48,23.98 | IC8.2 102.86,16.36 102.23,16.99 97.78,16.99 97.15,17.63 v97.15,18.9 | v101.59,76.05 v97.78,76.05 94.61,76.05 93.97,76.68 IC24.2 87.62,76.68 86.99,77.32 80.64,77.32 80,76.68 IC22.2 73.02,76.68 72.38,77.32 65.4,77.32 64.77,76.68 IC13.2 v52.7,76.68 | v109.21,76.05 123.82,76.05 124.45,75.41 v126.36,75.41 IC31.18 128.9,75.41 | v132.07,78.59 v137.79,78.59 | 144.78,75.41 IC25.15 v140.97,75.41 | IC15.18 31.11,59.54 32.38,60.81 IC39.2 v36.83,60.81 IC39.19 | IC39.19 45.08,60.81 | IC32.2 v36.83,44.3 | IC39.19 v52.7,60.81
  Bottom 0.254: v111.12,44.3 111.12,41.76 97.15,41.76 v97.15,39.85 | v101.59,76.05 v109.21,76.05 | v97.78,76.05 v97.78,58.9 | v126.36,75.41 126.36,78.59 v132.07,78.59 | v137.79,78.59 140.97,78.59 v140.97,75.41 | v36.83,44.3 v36.83,60.81 | v52.7,60.81 v52.7,76.68 | v110.48,23.98 110.48,23.34 108.58,21.44 97.15,21.44 v97.15,18.9
D1  (via drill 0.3)
  Top 0.254: v110.48,43.66 110.48,51.28 106.67,55.09 IC6.3 102.86,55.09 102.23,55.73 97.15,55.73 v97.15,59.54 | v96.52,39.22 96.52,36.68 97.15,36.04 102.23,36.04 102.86,35.41 IC7.3 106.67,35.41 109.85,31.6 v109.85,24.61 | IC8.3 102.86,15.09 102.23,15.72 97.15,15.72 96.52,16.36 v96.52,18.26 | v101.59,74.78 v97.15,74.78 94.61,74.78 93.97,75.41 IC24.3 87.62,75.41 86.99,76.05 80.64,76.05 80,75.41 IC22.3 73.02,75.41 72.38,76.05 65.4,76.05 64.77,75.41 IC13.3 v53.34,75.41 | v109.21,74.78 123.82,74.78 124.45,74.14 IC31.17 v130.81,74.14 | v130.81,75.41 134.62,75.41 135.88,76.68 IC25.1 | IC15.17 31.11,58.27 32.38,59.54 IC39.3 v37.46,59.54 IC39.18 | IC39.18 45.08,59.54 | IC32.3 v37.46,43.03 | IC39.18 v53.34,59.54
  Bottom 0.254: v110.48,43.66 110.48,42.39 96.52,42.39 v96.52,39.22 | v101.59,74.78 v109.21,74.78 | v97.15,74.78 v97.15,59.54 | v130.81,74.14 v130.81,75.41 | v37.46,43.03 v37.46,59.54 | v53.34,59.54 v53.34,75.41 | v109.85,24.61 109.85,23.34 108.58,22.07 97.15,22.07 96.52,21.44 v96.52,18.26
D2  (via drill 0.3)
  Top 0.254: v109.85,44.3 109.85,50.65 106.67,53.82 IC6.4 102.86,53.82 102.23,54.46 96.52,54.46 v96.52,58.9 | v95.88,39.85 95.88,36.04 97.15,34.77 102.23,34.77 102.86,34.14 IC7.4 106.67,34.14 109.21,30.96 v109.21,23.98 | IC8.4 102.86,13.82 102.23,14.45 97.15,14.45 95.88,15.72 v95.88,18.9 | v101.59,73.51 v96.52,73.51 94.61,73.51 93.97,74.14 IC24.4 87.62,74.14 86.99,74.78 80.64,74.78 80,74.14 IC22.4 73.02,74.14 72.38,74.78 65.4,74.78 64.77,74.14 IC13.4 v53.97,74.14 | v109.21,73.51 123.82,73.51 124.45,72.87 IC31.16 136.52,72.87 137.16,73.51 v140.97,73.51 | 144.78,69.06 IC25.10 v140.97,69.06 | IC15.16 31.11,57 32.38,58.27 IC39.4 v38.1,58.27 IC39.17 v53.97,58.27 | IC32.4 v38.1,41.76
  Bottom 0.254: v109.85,44.3 109.85,43.03 95.88,43.03 v95.88,39.85 | v101.59,73.51 v109.21,73.51 | v96.52,73.51 v96.52,58.9 | v140.97,73.51 v140.97,69.06 | v38.1,41.76 v38.1,58.27 | v53.97,58.27 v53.97,74.14 | v109.21,23.98 109.21,23.34 108.58,22.71 97.15,22.71 95.88,21.44 v95.88,18.9
D3  (via drill 0.3)
  Top 0.254: v109.21,43.66 109.21,50.01 106.67,52.55 IC6.5 102.86,52.55 102.23,53.19 95.88,53.19 v95.88,59.54 | v95.24,39.22 95.24,35.41 97.15,33.5 102.23,33.5 102.86,32.87 IC7.5 106.67,32.87 108.58,30.33 v108.58,24.61 | IC8.5 102.86,12.55 102.23,13.18 97.15,13.18 95.24,15.09 v95.24,18.26 | v101.59,72.24 v95.88,72.24 94.61,72.24 93.97,72.87 IC24.5 87.62,72.87 86.99,73.51 80.64,73.51 80,72.87 IC22.5 73.02,72.87 72.38,73.51 65.4,73.51 64.77,72.87 IC13.5 v54.61,72.87 | v109.21,72.24 123.82,72.24 124.45,71.6 IC31.15 135.25,71.6 135.88,72.24 v141.6,72.24 | 144.78,67.79 IC25.9 v141.6,67.79 | IC15.15 31.11,55.73 32.38,57 IC39.5 v38.73,57 IC39.16 | IC39.16 45.08,57 | IC32.5 v38.73,40.49 | IC39.16 v54.61,57
  Bottom 0.254: v109.21,43.66 95.24,43.66 v95.24,39.22 | v101.59,72.24 v109.21,72.24 | v95.88,72.24 v95.88,59.54 | v141.6,72.24 v141.6,67.79 | v38.73,40.49 v38.73,57 | v54.61,57 v54.61,72.87 | v108.58,24.61 108.58,23.34 97.15,23.34 95.24,21.44 v95.24,18.26
D4  (via drill 0.3)
  Top 0.254: v108.58,44.3 108.58,49.38 106.67,51.28 IC6.6 102.86,51.28 102.23,51.92 95.24,51.92 v95.24,58.9 | v94.61,39.85 94.61,34.14 96.52,32.23 102.23,32.23 102.86,31.6 IC7.6 106.67,31.6 107.94,29.69 v107.94,23.98 | IC8.6 102.86,11.28 102.23,11.91 97.15,11.91 94.61,14.45 v94.61,18.9 | v101.59,70.97 v95.24,70.97 94.61,70.97 93.97,71.6 IC24.6 87.62,71.6 86.99,72.24 80.64,72.24 80,71.6 IC22.6 73.02,71.6 72.38,72.24 65.4,72.24 64.77,71.6 IC13.6 v55.24,71.6 | v109.21,70.97 123.82,70.97 124.45,70.33 IC31.14 v132.71,70.33 | v133.34,77.32 v152.39,77.32 | 156.84,75.41 IC28.15 v154.3,75.41 | IC15.14 31.11,54.46 32.38,55.73 IC39.6 v39.37,55.73 IC39.15 | IC39.15 45.08,55.73 | IC32.6 v39.37,39.22 | IC39.15 v55.24,55.73
  Bottom 0.254: v108.58,44.3 94.61,44.3 v94.61,39.85 | v101.59,70.97 v109.21,70.97 | v95.24,70.97 v95.24,58.9 | v132.71,70.33 132.71,76.68 v133.34,77.32 | v152.39,77.32 v154.3,75.41 | v39.37,39.22 v39.37,55.73 | v55.24,55.73 v55.24,71.6 | v107.94,23.98 97.15,23.98 94.61,21.44 v94.61,18.9
D5  (via drill 0.3)
  Top 0.254: v107.31,24.61 107.31,29.06 106.67,30.33 IC7.7 102.86,30.33 102.23,30.96 96.52,30.96 93.97,33.5 v93.97,39.22 | v107.94,44.93 107.94,48.74 106.67,50.01 IC6.7 102.86,50.01 102.23,50.65 94.61,50.65 v94.61,59.54 | IC8.7 102.86,10.01 102.23,10.64 97.15,10.64 93.97,13.82 v93.97,18.26 | v101.59,69.7 v94.61,69.7 93.97,70.33 IC24.7 87.62,70.33 86.99,70.97 80.64,70.97 80,70.33 IC22.7 73.02,70.33 72.38,70.97 65.4,70.97 64.77,70.33 IC13.7 v55.88,70.33 | v109.21,69.7 123.82,69.7 124.45,69.06 IC31.13 133.34,69.06 133.98,69.7 v148.59,69.7 | v148.59,76.68 IC28.1 | IC15.13 31.11,53.19 32.38,54.46 IC39.7 v40,54.46 IC39.14 | IC39.14 45.08,54.46 | IC32.7 v40,37.95 | IC39.14 46.98,54.46 47.62,55.09 v55.88,55.09
  Bottom 0.254: v107.94,44.93 93.97,44.93 v93.97,39.22 | v93.97,18.26 93.97,21.44 97.15,24.61 v107.31,24.61 | v101.59,69.7 v109.21,69.7 | v94.61,69.7 v94.61,59.54 | v148.59,69.7 v148.59,76.68 | v40,37.95 v40,54.46 | v55.88,55.09 v55.88,70.33
D6  (via drill 0.3)
  Top 0.254: v107.31,45.57 107.31,48.11 106.67,48.74 IC6.8 102.86,48.74 102.23,49.38 93.97,49.38 v93.97,58.9 | v93.34,39.85 93.34,32.87 96.52,29.69 102.23,29.69 102.86,29.06 IC7.8 106.67,29.06 106.67,25.25 v105.41,25.25 | IC8.8 102.86,8.74 102.23,9.37 97.15,9.37 93.34,13.18 v93.34,18.9 | v101.59,68.43 93.97,68.43 93.34,69.06 v92.7,69.06 IC24.8 87.62,69.06 86.99,69.7 80.64,69.7 80,69.06 IC22.8 73.02,69.06 72.38,69.7 65.4,69.7 64.77,69.06 IC13.8 v56.51,69.06 | v109.21,68.43 123.82,68.43 124.45,67.79 IC31.12 v133.98,67.79 | v133.98,66.52 v154.3,66.52 | 156.84,69.06 IC28.10 v154.3,69.06 | IC15.12 31.11,51.92 32.38,53.19 IC39.8 v40.64,53.19 IC39.13 | IC39.13 45.08,53.19 | IC32.8 v40.64,36.68 | IC39.13 46.98,53.19 47.62,53.82 v56.51,53.82
  Bottom 0.254: v107.31,45.57 93.34,45.57 v93.34,39.85 | v93.34,18.9 93.34,21.44 97.15,25.25 v105.41,25.25 | v101.59,68.43 v109.21,68.43 | v93.97,58.9 93.97,67.79 v92.7,69.06 | v133.98,67.79 v133.98,66.52 | v154.3,66.52 v154.3,69.06 | v40.64,36.68 v40.64,53.19 | v56.51,53.82 v56.51,69.06
D7  (via drill 0.3)
  Top 0.254: v106.04,25.88 106.04,27.79 IC7.9 102.86,27.79 102.23,28.42 96.52,28.42 92.7,32.23 v92.7,39.22 | v106.67,46.2 106.67,46.84 106.04,47.47 IC6.9 102.86,47.47 102.23,48.11 93.34,48.11 v93.34,59.54 | IC8.9 102.86,7.47 102.23,8.1 96.52,8.1 92.7,11.91 v92.7,18.26 | v101.59,67.16 93.97,67.16 93.34,67.79 v92.7,67.79 IC24.9 87.62,67.79 86.99,68.43 80.64,68.43 80,67.79 IC22.9 73.02,67.79 72.38,68.43 65.4,68.43 64.77,67.79 IC13.9 v57.15,67.79 | v109.21,67.16 123.82,67.16 124.45,66.52 IC31.11 132.71,66.52 133.34,65.89 154.94,65.89 156.84,67.79 IC28.9 | IC15.11 31.11,50.65 32.38,51.92 IC39.9 v41.27,51.92 IC39.12 | IC39.12 45.08,51.92 | IC32.9 v41.27,35.41 | IC39.12 46.98,51.92 47.62,52.55 v57.15,52.55
  Bottom 0.254: v106.67,46.2 92.7,46.2 v92.7,39.22 | v92.7,18.26 92.7,21.44 97.15,25.88 v106.04,25.88 | v101.59,67.16 v109.21,67.16 | v93.34,59.54 93.34,66.52 v92.7,67.79 | v41.27,35.41 v41.27,51.92 | v57.15,52.55 v57.15,67.79
DATADIR  (via drill 0.3)
  Top 0.254: v17.77,62.08 IC15.1 | v17.77,69.7 v41.27,69.7 | v38.73,86.84 38.73,90.02 IC40.42
  Bottom 0.254: v41.27,69.7 41.27,76.68 38.1,79.86 38.1,86.21 v38.73,86.84 | v17.77,62.08 v17.77,69.7
FETCH/-STORE  (via drill 0.3)
  Top 0.254: v140.33,72.87 IC25.4 | v38.73,10.01 IC12.7 65.4,10.01 66.03,10.64 79.37,10.64 80,10.01 v80.64,10.01 | IC36.1 37.46,24.61 | v39.37,24.61 IC36.1 | v80.64,4.93 v85.08,4.93 | v135.88,43.66 v139.06,43.66 | IC36.1 35.55,24.61 34.92,25.25 34.92,27.15 33.65,28.42 32.38,28.42 31.74,29.06 v30.47,29.06
  Bottom 0.254: v140.33,72.87 140.33,65.25 138.42,63.35 138.42,44.93 139.06,44.3 v139.06,43.66 | v39.37,24.61 38.73,23.98 38.73,22.71 39.37,22.07 39.37,11.28 38.73,10.64 v38.73,10.01 37.46,10.01 36.83,9.37 JP11.1 | v80.64,10.01 v80.64,4.93 | v85.08,4.93 87.62,4.93 88.89,6.2 99.05,6.2 100.32,4.93 134.62,4.93 134.62,8.74 133.98,9.37 133.98,18.26 135.25,19.53 135.25,28.42 135.88,29.06 v135.88,43.66 | v30.47,29.06 30.47,62.71 29.84,63.35 IC40.18
GND  (via drill 0.3, 0.6)
  Top 0.254: 153.03,39.22 152.39,39.85 C23.2 | C45.2 152.39,60.81 | C3.2 122.55,61.44 | 152.39,79.86 C17.2 | C40.2 140.33,60.81 | IC6.10 104.13,46.2 | 93.97,3.66 C30.2 | 118.74,6.2 IC11.10 | 138.42,7.47 IC14.8 | C37.2 140.33,19.53 | 122.55,20.8 C2.2 | C11.2 64,20.04 63.5,19.53 | 107.94,6.2 107.81,6.33 | C38.2 93.34,23.98 | 104.13,26.52 IC7.10 | C6.2 122.55,40.49 | 107.81,39.98 v107.94,39.85 | C13.2 64.13,41.12 | C21.2 78.73,41.12 | 118.74,66.52 IC31.10 | 107.81,62.84 107.81,62.58 | 104.13,66.52 IC23.10 v107.31,66.52 | 74.92,66.52 IC22.10 | 107.63,82.72 107.81,82.53 C26.2 107.94,81.76 | 93.34,81.76 C34.2 | v107.31,75.41 IC23.3 | v107.31,74.14 IC23.4 | v107.31,72.87 IC23.5 | v107.31,71.6 IC23.6 | v107.31,70.33 IC23.7 | v107.31,69.06 IC23.8 | v107.31,67.79 IC23.9 | v107.31,76.68 IC23.2 | C22.2 38.73,48.11 | C32.2 23.49,48.11 | v20.95,48.11 21.58,48.11 | 22.86,43.03 23.49,42.39 v32.38,42.39 | 29.84,40.49 IC26.16 | 24.12,14.45 C24.2 | C12.2 38.73,65.89 | 89.53,66.52 IC24.10 | 74.92,44.93 v75.61,44.88 | v57.78,43.66 v33.02,43.66 | 78.73,20.8 C14.2 78.73,20.17 78.73,20.8
  Top 0.406: 140.33,62.08 147.31,62.08
  Top 0.61: v136.52,27.79 IC5.8 | v152.39,27.79 IC4.8 150.59,25.98 149.22,24.61 141.6,24.61 140.97,23.98 139.69,23.98 139.06,24.61 v136.52,24.61 | v153.03,37.95 153.03,39.22 | v136.52,47.47 IC3.8 | v136.52,67.79 IC25.8 | v148.59,67.79 IC28.8 | v137.16,60.81 C40.2 | C45.2 v149.85,60.81 148.59,60.81 147.31,62.08 | 122.55,61.44 v122.55,58.9 | C10.2 140.2,81.63 140.33,81.76 | 140.33,81.76 142.23,83.67 150.49,83.67 152.39,81.76 152.39,79.86 150.49,79.86 v149.22,78.59 | 140.33,60.81 140.33,62.08 | 104.13,46.2 104.13,44.3 106.67,41.76 C7.2 107.81,39.98 | IC6.10 102.23,46.2 100.96,44.93 92.07,44.93 90.8,46.2 IC16.10 87.62,46.2 86.35,44.93 74.92,44.93 73.66,44.93 73.02,45.57 72.38,45.57 71.75,44.93 v57.78,44.93 | v40,15.72 IC36.8 | v40,23.34 IC36.15 v57.15,23.34 | v63.5,6.2 IC12.10 | IC21.10 76.83,6.2 v77.46,5.56 79.37,3.66 85.72,3.66 88.26,6.2 IC18.10 92.7,6.2 93.97,4.93 93.97,3.66 93.97,2.39 94.61,1.75 97.78,1.75 v98.42,2.39 99.05,2.39 102.23,6.2 IC8.10 107.94,6.2 109.85,4.29 114.93,4.29 116.83,6.2 118.74,6.2 v118.74,3.02 | IC11.10 121.91,6.2 123.82,4.29 130.17,4.29 v133.34,7.47 138.42,7.47 v138.42,3.02 | 136.52,19.53 v133.34,19.53 132.07,19.53 128.9,22.71 123.19,22.71 122.55,22.07 | 136.52,19.53 C37.2 | 122.55,22.07 122.55,20.8 120.64,18.9 v115.56,18.9 | v77.46,18.26 78.73,20.17 v76.83,20.17 | v63.5,18.26 63.5,19.53 | 107.81,6.33 C43.2 v106.04,20.17 | v103.5,20.17 103.5,20.8 104.13,21.44 104.13,26.52 102.23,26.52 100.96,25.25 98.42,25.25 97.78,25.88 93.97,25.88 93.21,25.12 C38.2 91.44,23.98 v90.8,24.61 | IC17.10 89.58,25.83 v90.8,24.61 | v57.78,20.17 C11.2 | v57.78,26.52 IC2.10
  Top 0.61: IC20.10 77.46,26.52 v77.46,24.61 | IC10.10 118.79,25.83 122.55,22.07 | 136.52,19.53 v136.52,20.17 | v149.85,43.03 146.68,43.03 146.04,43.66 144.78,43.66 144.14,43.03 141.6,43.03 140.84,42.26 C5.2 v137.79,41.12 133.98,41.12 132.71,42.39 118.74,42.39 | 152.39,39.85 v149.85,39.85 | IC9.10 118.79,42.34 118.74,40.49 | 118.74,40.49 C6.2 | v114.93,39.85 118.74,39.85 118.74,40.49 | v57.78,41.12 C13.2 | v57.78,46.2 IC1.10 | v75.56,41.12 C21.2 | v75.61,44.88 74.92,45.57 74.98,45.62 IC19.10 | v148.59,47.47 IC29.8 | C3.2 121.28,61.44 118.74,63.98 | 118.74,63.98 118.74,66.52 | C4.2 107.81,62.58 109.21,63.98 118.74,63.98 | 107.81,62.84 106.04,64.62 105.41,64.62 v104.77,65.25 | v104.77,65.25 104.13,65.89 104.13,66.52 | v75.56,61.44 C18.2 | v75.56,65.25 74.92,65.89 74.92,66.52 | v75.56,65.25 v78.73,65.25 86.35,65.25 86.99,65.89 v87.62,65.89 88.26,66.52 89.53,66.52 v91.44,66.52 92.07,65.89 97.78,65.89 98.42,65.25 v104.77,65.25 | v88.89,61.44 C8.2 | v61.59,61.44 C25.2 | v75.56,65.25 74.92,65.25 74.29,64.62 71.75,64.62 71.11,65.25 v62.23,65.25 v58.41,65.25 | C42.2 73.02,97.64 v71.75,96.37 | IC33.7 71.75,86.21 v71.11,86.84 70.48,86.21 62.23,86.21 v61.59,86.84 v53.34,86.84 | v96.52,86.84 97.15,86.21 IC27.7 | v98.42,97.64 C19.2 | C33.2 120.64,81.13 118.74,83.03 112.39,83.03 111.75,83.67 108.58,83.67 107.63,82.72 106.67,83.67 v96.52,83.67 93.97,83.67 93.34,83.03 93.34,81.76 v91.44,81.76 v88.89,82.4 | v105.41,81.13 106.04,81.76 C26.2 | v61.59,81.76 C28.2 | v71.11,81.76 v76.19,81.76 C29.2 | v58.41,66.52 IC13.10 | v53.34,84.3 C36.2 | v50.8,77.95 46.98,77.95 46.35,78.59 IC40.31 44.45,78.59 43.18,79.86 35.55,79.86 v34.92,79.22 32.38,79.22 31.74,79.86 v31.74,82.4
  Top 0.61: IC40.23 33.65,74.78 v33.65,70.97 | C44.2 23.49,84.3 24.12,84.94 28.57,84.94 IC40.10 | 7.62,79.22 8.89,77.95 12.7,77.95 13.33,77.32 | v20.95,65.25 C27.2 | v33.02,40.49 29.84,40.49 v26.03,40.49 | v33.02,45.57 IC32.1 34.29,45.57 34.34,46.89 34.34,48.06 34.29,48.11 34.92,48.11 | 34.92,48.11 C22.2 | v33.02,50.65 IC39.10 | 34.92,48.11 v33.02,48.11 | IC26.3 v22.22,43.03 22.86,43.03 | C32.2 21.58,48.11 21.58,50.65 IC15.10 | v33.02,34.14 IC32.10 | IC26.10 v22.22,34.14 v24.12,34.14 | C1.- 17.77,4.93 19.68,3.02 IC34.7 v25.39,3.02 | v25.39,11.91 24.76,11.91 24.12,12.55 24.12,14.45 | C12.2 37.46,65.89 36.83,65.25 33.65,65.25 v33.02,65.89 31.74,65.89 29.84,67.16 v21.58,67.16 | v91.44,77.95 IC24.1 | C31.2 v36.83,27.79 34.92,29.69 v33.02,29.69 | 107.94,18.26 111.75,18.26 v112.39,18.9 | v57.78,24.61 v77.46,24.61 | v77.46,24.61 v90.8,24.61 | 140.33,81.76 138.42,83.67 123.19,83.67 122.55,83.03 122.55,81.13
  Top 0.813: C46.- 11.43,93.19 10.79,92.56 P1.C32 P1.A32 P1.A31 P1.A30 P1.A29 P1.A28 7.62,79.22 | 13.33,77.32 SV1.2 | C1.- 14.6,4.93 13.33,6.2 13.33,10.01 12.7,10.64 P1.C1
  Bottom 0.254: 110.48,75.41 v107.31,75.41 | 110.48,77.95 110.48,76.68 | 110.48,76.68 110.48,75.41 | 110.48,74.14 v107.31,74.14 | 110.48,75.41 110.48,74.14 | 110.48,72.87 v107.31,72.87 | 110.48,74.14 110.48,72.87 | 110.48,71.6 v107.31,71.6 | 110.48,72.87 110.48,71.6 | 110.48,70.33 v107.31,70.33 | 110.48,71.6 110.48,70.33 | 110.48,69.06 v107.31,69.06 | 110.48,69.06 110.48,70.33 | 110.48,67.79 v107.31,67.79 | 110.48,67.79 110.48,69.06 | v107.31,66.52 110.48,66.52 110.48,67.79 | 110.48,76.68 v107.31,76.68
  Bottom 0.406: 110.48,77.95 107.94,77.95 105.41,80.49 v105.41,81.13
  Bottom 0.61: v153.03,37.95 153.03,29.69 152.39,29.06 v152.39,27.79 152.39,23.34 147.95,23.34 147.95,3.02 v138.42,3.02 v118.74,3.02 100.32,3.02 99.69,2.39 v98.42,2.39 78.1,2.39 77.46,3.02 76.83,3.02 | v149.22,78.59 149.85,77.95 149.85,69.06 v148.59,67.79 148.59,65.89 150.49,63.98 150.49,63.35 149.85,62.71 v149.85,60.81 | 136.52,63.35 136.52,61.44 v137.16,60.81 137.16,57.63 136.52,57 v136.52,47.47 136.52,45.57 137.79,44.3 v137.79,41.12 | 136.52,63.35 136.52,63.98 137.16,64.62 137.16,65.89 136.52,66.52 v136.52,67.79 | 136.52,63.35 135.25,63.35 130.17,58.27 128.27,58.27 127.63,58.9 v122.55,58.9 | v133.34,7.47 v133.34,19.53 | v77.46,18.26 v77.46,5.56 76.83,4.93 76.83,3.02 | v63.5,18.26 v63.5,6.2 63.5,3.02 | v106.04,20.17 v103.5,20.17 | 57.78,23.34 v57.78,20.17 | 57.78,23.34 v57.78,24.61 v57.78,26.52 v57.78,41.12 v57.78,43.66 v57.78,44.93 v57.78,46.2 | v77.46,24.61 77.46,20.8 v76.83,20.17 | 77.46,26.52 77.46,38.58 v75.56,41.12 v75.61,44.88 | v57.15,23.34 57.78,23.34 | v136.52,20.17 v136.52,24.61 v136.52,27.79 | v149.85,39.85 v149.85,43.03 149.85,44.93 148.59,46.2 v148.59,47.47 | v107.94,39.85 v114.93,39.85 | v75.56,65.25 v75.56,61.44 75.56,44.93 | v87.62,65.89 88.89,64.62 v88.89,61.44 | v62.23,65.25 62.23,62.08 v61.59,61.44 | v71.75,96.37 71.75,90.02 71.11,89.38 v71.11,86.84 v71.11,81.76 | v71.75,96.37 89.53,96.37 | 89.53,96.37 96.52,96.37 | 96.52,96.37 97.78,96.37 98.42,97 v98.42,97.64 | 96.52,96.37 v96.52,86.84 v96.52,83.67 | v88.89,82.4 89.53,83.03 89.53,96.37 | v61.59,86.84 v61.59,81.76 | v58.41,65.25 v58.41,66.52 | v53.34,86.84 v53.34,84.3 | v50.8,77.95 50.8,83.67 C36.2 | IC40.23 v34.92,79.22
  Bottom 0.61: C16.2 28.57,95.73 28.57,87.48 IC40.10 30.47,84.94 31.74,83.67 v31.74,82.4 | SV1.2 17.14,77.32 18.41,76.05 18.41,72.24 19.04,71.6 C35.2 v21.58,67.16 20.95,66.52 v20.95,65.25 v20.95,48.11 20.95,46.84 22.22,45.57 v22.22,43.03 20.95,41.76 20.95,35.41 v22.22,34.14 22.22,33.5 21.58,32.87 JP1.1 21.58,20.8 25.39,16.99 v25.39,11.91 v25.39,3.02 40,3.02 | v33.02,45.57 v33.02,43.66 33.02,43.03 v32.38,42.39 33.02,41.76 v33.02,40.49 v33.02,34.14 v33.02,29.69 | v33.02,48.11 v33.02,50.65 | v24.12,34.14 26.03,36.68 v26.03,40.49 | v33.02,65.89 32.38,66.52 32.38,69.7 v33.65,70.97 | v91.44,66.52 v91.44,77.95 v91.44,81.76 | v36.83,27.79 36.83,25.88 40,25.88 40.64,25.25 40.64,23.98 v40,23.34 v40,15.72 40,3.02 | 40,3.02 63.5,3.02 | 63.5,3.02 76.83,3.02 | v115.56,18.9 v112.39,18.9 | v76.19,81.76 76.19,79.86 78.73,77.32 v78.73,65.25 | 19.04,93.19 22.22,96.37 C16.2 | C16.2 30.47,97.64 70.48,97.64 v71.75,96.37
  Bottom 0.813: P1.A28 3.17,79.22 3.17,10.64 P1.A1 P1.C1 | C46.- 19.04,93.19 20.95,91.29 20.95,84.94 C44.2
  pour Bottom (isolate 0.813): 6.98,98.91 158.75,98.91 158.75,1.12 6.98,1.12 6.98,8.1 1.9,8.1 1.9,91.92 6.98,91.92
INBUS0  (via drill 0.3)
  Top 0.254: IC19.2 79.37,56.36 80,55.73 86.35,55.73 86.99,56.36 IC16.2 v91.44,56.36 | v111.75,55.73 112.39,55.09 IC6.18 | IC6.18 114.3,55.09 | IC6.18 116.2,55.09 116.83,55.73 123.82,55.73 124.45,55.09 IC9.18 128.9,55.09
  Bottom 0.254: v91.44,56.36 93.97,56.36 94.61,55.73 v111.75,55.73
INBUS1  (via drill 0.3)
  Top 0.254: IC19.3 79.37,55.09 80,54.46 86.35,54.46 86.99,55.09 IC16.3 v91.44,55.09 | v111.75,54.46 112.39,53.82 IC6.17 | IC6.17 114.3,53.82 | IC6.17 116.2,53.82 116.83,54.46 123.82,54.46 124.45,53.82 IC9.17 128.9,53.82
  Bottom 0.254: v91.44,55.09 93.97,55.09 94.61,54.46 v111.75,54.46
INBUS2  (via drill 0.3)
  Top 0.254: IC19.4 79.37,53.82 80,53.19 86.35,53.19 86.99,53.82 IC16.4 v91.44,53.82 | v111.75,53.19 112.39,52.55 IC6.16 | IC6.16 114.3,52.55 | IC6.16 116.2,52.55 116.83,53.19 123.82,53.19 124.45,52.55 IC9.16 128.9,52.55
  Bottom 0.254: v91.44,53.82 93.97,53.82 94.61,53.19 v111.75,53.19
INBUS3  (via drill 0.3)
  Top 0.254: IC19.5 79.37,52.55 80,51.92 86.35,51.92 86.99,52.55 IC16.5 v91.44,52.55 | v111.75,51.92 112.39,51.28 IC6.15 | IC6.15 114.3,51.28 | IC6.15 116.2,51.28 116.83,51.92 123.82,51.92 124.45,51.28 IC9.15 128.9,51.28
  Bottom 0.254: v91.44,52.55 93.97,52.55 94.61,51.92 v111.75,51.92
INBUS4  (via drill 0.3)
  Top 0.254: IC19.6 79.37,51.28 80,50.65 86.35,50.65 86.99,51.28 IC16.6 v91.44,51.28 | v111.75,50.65 112.39,50.01 IC6.14 | IC6.14 114.93,50.01 | IC6.14 116.2,50.01 116.83,50.65 123.82,50.65 124.45,50.01 IC9.14 128.9,50.01
  Bottom 0.254: v91.44,51.28 93.97,51.28 94.61,50.65 v111.75,50.65
INBUS5  (via drill 0.3)
  Top 0.254: IC19.7 79.37,50.01 80,49.38 86.35,49.38 86.99,50.01 IC16.7 v91.44,50.01 | v111.75,49.38 112.39,48.74 IC6.13 | IC6.13 114.3,48.74 | IC6.13 116.2,48.74 116.83,49.38 123.82,49.38 124.45,48.74 IC9.13 128.9,48.74
  Bottom 0.254: v91.44,50.01 93.97,50.01 94.61,49.38 v111.75,49.38
INBUS6  (via drill 0.3)
  Top 0.254: IC19.8 79.37,48.74 80,48.11 86.35,48.11 86.99,48.74 IC16.8 v91.44,48.74 | v111.75,48.11 112.39,47.47 IC6.12 | IC6.12 114.3,47.47 | IC6.12 116.2,47.47 116.83,48.11 123.82,48.11 124.45,47.47 IC9.12 128.9,47.47
  Bottom 0.254: v91.44,48.74 93.97,48.74 94.61,48.11 v111.75,48.11
INBUS7  (via drill 0.3)
  Top 0.254: IC19.9 79.37,47.47 80,46.84 86.35,46.84 86.99,47.47 IC16.9 v91.44,47.47 | v111.75,46.84 112.39,46.2 IC6.11 | IC6.11 114.3,46.2 | IC6.11 116.2,46.2 116.83,46.84 123.82,46.84 124.45,46.2 IC9.11 128.9,46.2
  Bottom 0.254: v91.44,47.47 93.97,47.47 94.61,46.84 v111.75,46.84
INBUS8  (via drill 0.3)
  Top 0.254: IC20.2 79.37,36.68 80,36.04 86.35,36.04 86.99,36.68 IC17.2 v91.44,36.68 | v111.75,36.04 112.39,35.41 IC7.18 | IC7.18 114.3,35.41 | IC7.18 116.2,35.41 116.83,36.04 123.82,36.04 124.45,35.41 IC10.18 128.9,35.41
  Bottom 0.254: v91.44,36.68 94.61,36.68 95.24,36.04 v111.75,36.04
INBUS9  (via drill 0.3)
  Top 0.254: IC20.3 79.37,35.41 80,34.77 86.35,34.77 86.99,35.41 IC17.3 v91.44,35.41 | v111.75,34.77 112.39,34.14 IC7.17 | IC7.17 114.93,34.14 | IC7.17 116.2,34.14 116.83,34.77 123.82,34.77 124.45,34.14 IC10.17 128.9,34.14
  Bottom 0.254: v91.44,35.41 94.61,35.41 95.24,34.77 v111.75,34.77
INBUS10  (via drill 0.3)
  Top 0.254: IC20.4 79.37,34.14 80,33.5 86.35,33.5 86.99,34.14 IC17.4 v91.44,34.14 | v111.75,33.5 112.39,32.87 IC7.16 | IC7.16 114.93,32.87 | IC7.16 116.2,32.87 116.83,33.5 123.82,33.5 124.45,32.87 IC10.16 129.53,32.87
  Bottom 0.254: v91.44,34.14 94.61,34.14 95.24,33.5 v111.75,33.5
INBUS11  (via drill 0.3)